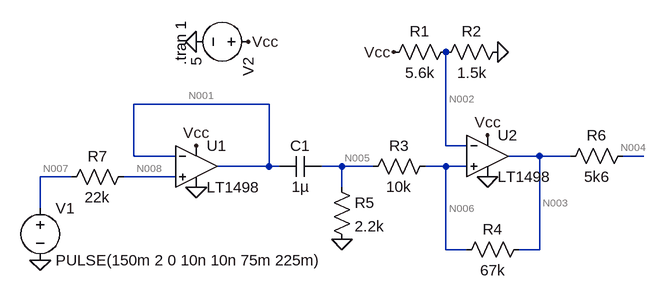
[diagram p0: schematic iot-projekti-wind-speed.asc]
iot-projekti-wind-speed.asc, the LTspice schematic file:
Version 4
SHEET 1 1000 680
WIRE 160 -16 -48 -16
WIRE 432 48 432 -96
WIRE 464 48 432 48
WIRE -48 64 -48 -16
WIRE 16 64 -48 64
WIRE 576 64 528 64
WIRE 624 64 576 64
WIRE 736 64 704 64
WIRE 160 80 160 -16
WIRE 160 80 80 80
WIRE 176 80 160 80
WIRE 272 80 240 80
WIRE 320 80 272 80
WIRE 432 80 400 80
WIRE 464 80 432 80
WIRE -144 96 -192 96
WIRE 16 96 -64 96
WIRE 272 112 272 80
WIRE -192 144 -192 96
WIRE 432 208 432 80
WIRE 464 208 432 208
WIRE 576 208 576 64
WIRE 576 208 544 208
FLAG -192 224 0
FLAG 48 -112 0
FLAG 128 -112 Vcc
FLAG 48 48 Vcc
FLAG 496 32 Vcc
FLAG 48 112 0
FLAG 496 96 0
FLAG 352 -96 Vcc
FLAG 512 -96 0
FLAG 272 192 0
SYMBOL OpAmps\\LT1498 48 16 R0
SYMATTR InstName U1
SYMBOL voltage -192 128 R0
WINDOW 123 0 0 Left 0
WINDOW 39 0 0 Left 0
SYMATTR InstName V1
SYMATTR Value PULSE(150m 2 0 10n 10n 75m 225m)
SYMBOL voltage 144 -112 R90
WINDOW 123 0 0 Left 0
WINDOW 39 0 0 Left 0
SYMATTR InstName V2
SYMATTR Value 5
SYMBOL OpAmps\\LT1498 496 0 R0
SYMATTR InstName U2
SYMBOL res 448 -112 R90
WINDOW 0 0 56 VBottom 2
WINDOW 3 32 56 VTop 2
SYMATTR InstName R1
SYMATTR Value 5.6k
SYMBOL res 528 -112 R90
WINDOW 0 0 56 VBottom 2
WINDOW 3 32 56 VTop 2
SYMATTR InstName R2
SYMATTR Value 1.5k
SYMBOL res 416 64 R90
WINDOW 0 0 56 VBottom 2
WINDOW 3 32 56 VTop 2
SYMATTR InstName R3
SYMATTR Value 10k
SYMBOL res 560 192 R90
WINDOW 0 0 56 VBottom 2
WINDOW 3 32 56 VTop 2
SYMATTR InstName R4
SYMATTR Value 67k
SYMBOL cap 240 64 R90
WINDOW 0 0 32 VBottom 2
WINDOW 3 32 32 VTop 2
SYMATTR InstName C1
SYMATTR Value 1µ
SYMBOL res 256 96 R0
SYMATTR InstName R5
SYMATTR Value 2.2k
SYMBOL res 720 48 R90
WINDOW 0 0 56 VBottom 2
WINDOW 3 32 56 VTop 2
SYMATTR InstName R6
SYMATTR Value 5k6
SYMBOL res -48 80 R90
WINDOW 0 0 56 VBottom 2
WINDOW 3 32 56 VTop 2
SYMATTR InstName R7
SYMATTR Value 22k
TEXT 24 -144 VRight 2 !.tran 1

The netlist it stands for:
* iot-projekti-wind-speed.asc
XU1 N008 N001 Vcc 0 N001 LT1498  ; pins In+ In- V+ V- OUT
V1 N007 0 PULSE(150m 2 0 10n 10n 75m 225m)
V2 Vcc 0 5
XU2 N006 N002 Vcc 0 N003 LT1498  ; pins In+ In- V+ V- OUT
R1 N002 Vcc 5.6k
R2 0 N002 1.5k
R3 N006 N005 10k
R4 N003 N006 67k
C1 N005 N001 1µ
R5 N005 0 2.2k
R6 N004 N003 5k6
R7 N008 N007 22k
.tran 1
.lib LTC.lib
.backanno
.end

* Results of the author's LTspice run, read from the files saved beside the schematic
* Operating Point, zero values left out:
*   V(n001) = 155.6 mV
*   V(n008) = 155.6 mV
*   V(vcc) = 5 V
*   V(n007) = 150 mV
*   V(n002) = 1.036 V
*   V(n006) = 183.1 mV
*   V(n003) = 81.35 µV
*   V(n005) = 33.01 mV
*   V(n004) = 81.35 µV
*   I(R7) = 254.9 nA
*   I(R5) = 15.01 µA
*   I(R4) = -2.731 µA
*   I(R3) = 15.01 µA
*   I(R2) = -690.6 µA
*   I(R1) = -707.9 µA
*   I(V2) = -3.06 mA
*   I(V1) = 254.9 nA
*   Ix(u1:1) = -254.9 nA
*   Ix(u1:2) = -254.9 nA
*   Ix(u1:3) = 1.7 mA
*   Ix(u1:4) = -1.7 mA
*   Ix(u1:5) = 254.9 nA
*   Ix(u2:1) = -17.74 µA
*   Ix(u2:2) = 17.23 µA
*   Ix(u2:3) = 651.8 µA
*   Ix(u2:4) = -654 µA
*   Ix(u2:5) = 2.731 µA